# EAGLE schematic oldlight (EAGLE 9.6.2)
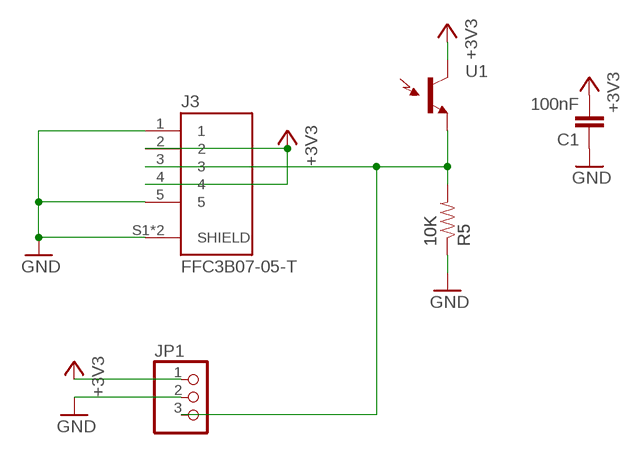
[diagram p0: schematic, sheet 1]

## Parts
C1  100nF  CAP0805  [0805]
J3  FFC3B07-05-T  [GCT_FFC3B07-05-T]
JP1  PINHD-1X3CB  [1X03-CLEANBIG]
R5  10K  RESISTOR0805-RES  [0805]
U1  TEMT6000  [TEMT6000-SEN]

## Nets
+3V3: C1.2 J3.2 J3.4 JP1.1 U1.COLLECTOR(C1)
GND: C1.1 J3.1 J3.5 J3.S1(SHIELD) J3.S2(SHIELD) JP1.2 R5.1
S: J3.3 JP1.3 R5.2 U1.EMITTER(E1)

## Library data of the parts
C1 = clock:CAP: Capacitor Standard 0603 ceramic capacitor, and 0.1" leaded capacitor.
J3 = FFC3B07-05-T:FFC3B07-05-T: FPC 1.0mm Pitch, Side entry, Top contact, SMT, Height 2.5mm, Slide type Check availability <https://pricing.snapeda.com/parts/FFC3B07-05-T/Global%20Connector%20Technology/view-part?ref=eda>; AVAILABILITY: In Stock; CHECK_PRICES: https://www.snapeda.com/parts/FFC3B07-05-T/Global+Connector+Technology/view-part/?ref=eda; DESCRIPTION: 5 Position FFC, FPC Connector Contacts, Bottom 0.039 (1.00mm) Surface Mount, Right Angle; MF: Global Connector Technology; MP: FFC3B07-05-T; PACKAGE: None; PRICE: None; SNAPEDA_LINK: https://www.snapeda.com/parts/FFC3B07-05-T/Global+Connector+Technology/view-part/?ref=snap
JP1 = adafruit_changed:PINHD-1X3: PIN HEADER
R5 = joyAnalog:RESISTOR: Resistor Basic schematic elements and footprints for 0603, 1206, and PTH resistors.
U1 = SparkFun:TEMT6000: Ambient Light Sensor Simple light detection sensor. Output varies with light intensity input. Spark Fun Electronics SKU : COM-08348